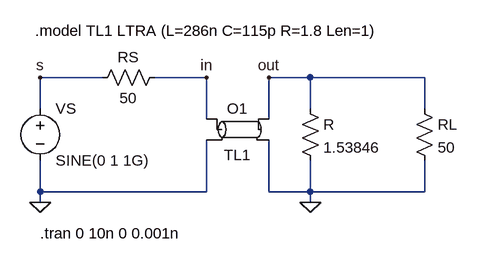
[diagram p0: schematic assig6_q1.asc]
assig6_q1.asc, the LTspice schematic file:
Version 4
SHEET 1 880 680
WIRE 176 64 80 64
WIRE 336 64 256 64
WIRE 496 64 432 64
WIRE 672 64 496 64
WIRE 80 112 80 64
WIRE 496 112 496 64
WIRE 672 112 672 64
WIRE 336 128 336 64
WIRE 432 128 432 64
WIRE 80 240 80 192
WIRE 336 240 336 160
WIRE 336 240 80 240
WIRE 432 240 432 160
WIRE 496 240 496 192
WIRE 496 240 432 240
WIRE 672 240 672 192
WIRE 672 240 496 240
WIRE 80 256 80 240
WIRE 496 256 496 240
FLAG 80 256 0
FLAG 496 256 0
FLAG 336 64 in
FLAG 80 64 s
FLAG 432 64 out
SYMBOL voltage 80 96 R0
WINDOW 123 0 0 Left 0
WINDOW 39 0 0 Left 0
SYMATTR InstName VS
SYMATTR Value SINE(0 1 1G)
SYMBOL res 272 48 R90
WINDOW 0 0 56 VBottom 2
WINDOW 3 32 56 VTop 2
SYMATTR InstName RS
SYMATTR Value 50
SYMBOL res 656 96 R0
SYMATTR InstName RL
SYMATTR Value 50
SYMBOL res 480 96 R0
SYMATTR InstName R
SYMATTR Value 1.53846
SYMBOL ltline 384 144 R0
WINDOW 3 0 24 Top 2
SYMATTR InstName O1
SYMATTR Value TL1
TEXT 80 304 Left 2 !.tran 0 10n 0 0.001n
TEXT 72 -8 Left 2 !.model TL1 LTRA (L=286n C=115p R=1.8 Len=1)

The netlist it stands for:
* assig6_q1.asc
VS s 0 SINE(0 1 1G)
RS in s 50
RL out 0 50
R out 0 1.53846
O1 in 0 out 0 TL1
.tran 0 10n 0 0.001n
.model TL1 LTRA (L=286n C=115p R=1.8 Len=1)
.backanno
.end